# Altium project RF315Mhz.PrjPcb
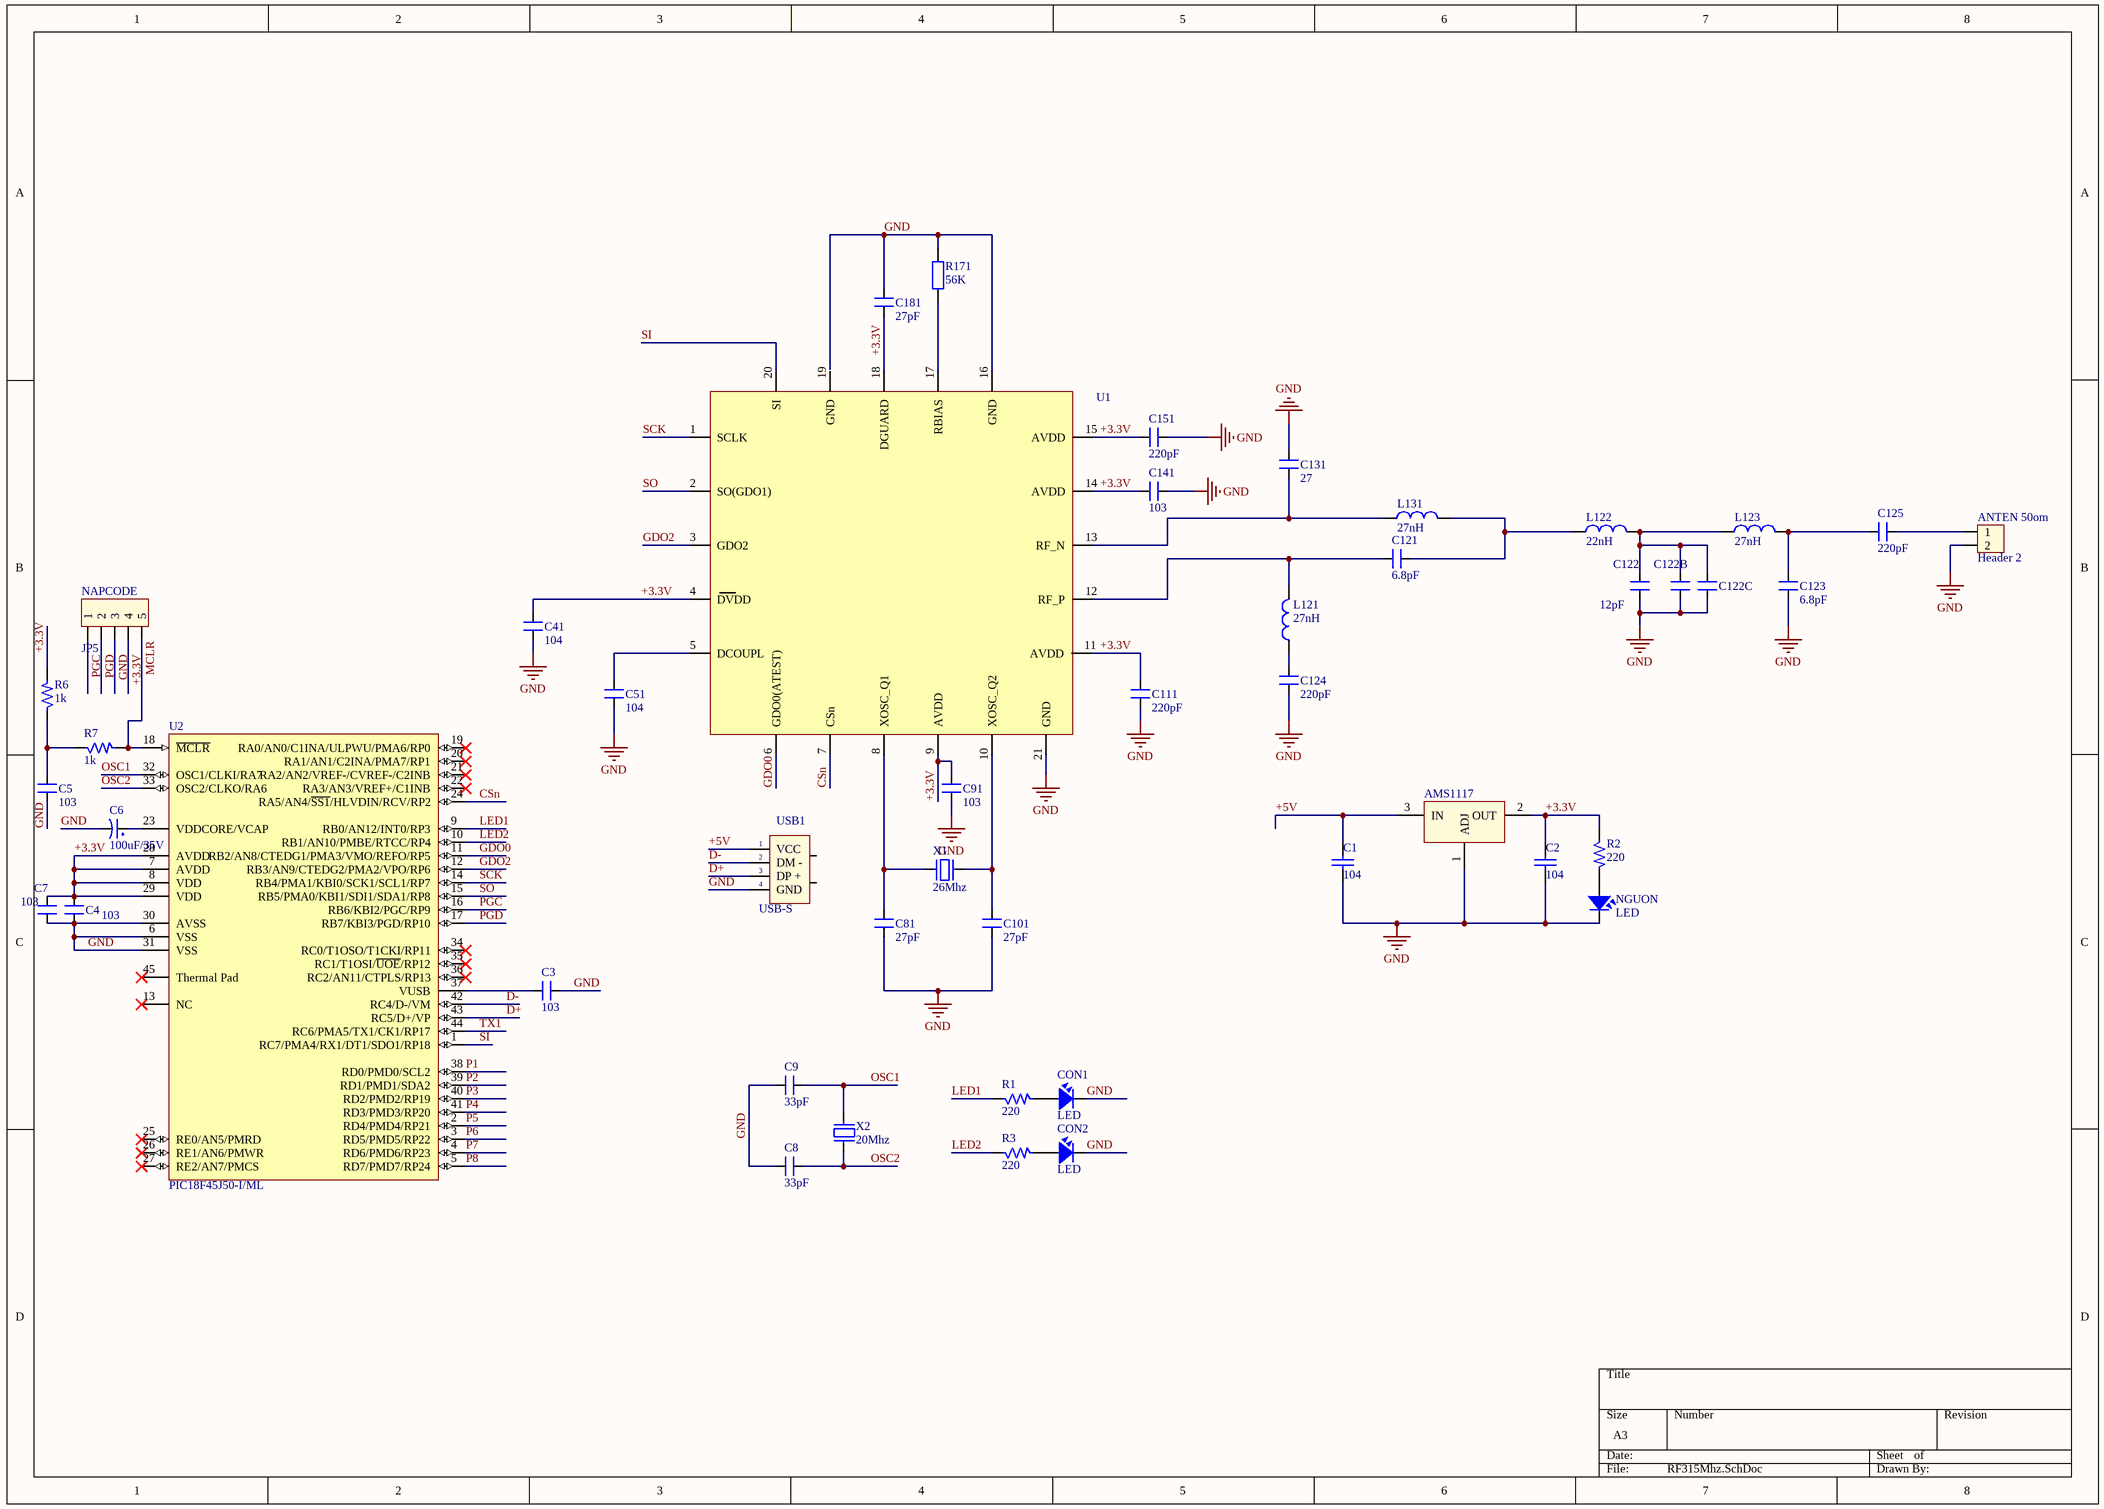
[diagram p0: RF315Mhz.SchDoc]
1 sheet, 47 parts. Net scope: global (net labels, ports and power ports of the same name join across sheets).
Board file: PCB1.PcbDoc

## Sheet RF315Mhz.SchDoc
size A3; PageSetup: Record=PageOptions|CenterHorizontal=True|CenterVertical=True|PrintScale=1.00|XCorrection=1.00|YCorrection=1.00|PrintKind=1|BorderSize=5000000|LeftOffset=0|BottomOffset=0|Orientation=2|PaperLength=1000|PaperWidth=1000|Scale=100|PaperSource=7|PrintQuality=-4|MediaType=1|DitherType=10|PaperKind=A4|PrintScaleMode=1

### Parts
AMS1117  LM317  [SOT223-4N]  (value not drawn)
ANTEN_50om  Header 2  [MCX5.08-H5]
C1  104  [0603ESDA]
C2  104  [0603ESDA]
C3  103  [SM-0805]
C4  103  [SM-0805]
C5  103  [SM-0805]
C6  100uF/35V  [CP1/2.5_SM]
C7  103  [SM-0805]
C8  33pF  [SM-0805]
C9  33pF  [SM-0805]
C41  104  [0603ESDA]
C51  104  [0603ESDA]
C81  27pF  [0603ESDA]
C91  103  [0603ESDA]
C101  27pF  [0603ESDA]
C111  220pF  [0603ESDA]
C121  6.8pF  [0603ESDA]
C122  12pF  [0603ESDA]
C122B  12pF  [0603ESDA]  (value not drawn)
C122C  12pF  [0603ESDA]  (value not drawn)
C123  6.8pF  [0603ESDA]
C124  220pF  [0603ESDA]
C125  220pF  [0603ESDA]
C131  27  [0603ESDA]
C141  103  [0603ESDA]
C151  220pF  [0603ESDA]
C181  27pF  [0603ESDA]
CON1  LED  [LED3mm]
CON2  LED  [LED3mm]
L121  27nH  [SM-0805]
L122  22nH  [SM-0805]
L123  27nH  [SM-0805]
L131  27nH  [SM-0805]
NAPCODE  JP5  [CON5]
NGUON  LED  [LED0805]
R1  220  [SM-0805]
R2  220  [SM-0805]
R3  220  [SM-0805]
R6  1k  [SM-0805]
R7  1k  [SM-0805]
R171  56K  [SM-0805]
U1  CC1101  [QFN-20Pin]  (value not drawn)
U2  PIC18F45J50-I/ML  [PIC18F45J50SMD]
USB1  USB-S  [USB-A]
X1  26Mhz  [XT2]
X2  20Mhz  [XT2]

### Nets
GND: AMS1117.1(ADJ) ANTEN_50om.2 C1.1 C2.1 C3.2 C4.2 C5.1 C6.2 C7.1 C8.1 C9.1 C41.1 C51.1 C81.1 C91.1 C101.1 C111.1 C122.2 C122B.2 C122C.2 C123.2 C124.1 C131.2 C141.1 C151.2 C181.2 CON1.2 CON2.2 NAPCODE.3 NGUON.2 R171.2 U1.16(GND) U1.21(GND) U2.6(VSS) U2.30(AVSS) U2.31(VSS) USB1.4(GND)
+3.3V: AMS1117.2(OUT) C2.2 C4.1 C7.2 C41.2 C91.2 C111.2 C141.2 C151.1 C181.1 NAPCODE.4 R2.1 R6.2 U1.4(DVDD) U1.9(AVDD) U1.11(AVDD) U1.14(AVDD) U1.15(AVDD) U1.18(DGUARD) U2.7(AVDD) U2.8(VDD) U2.28(AVDD) U2.29(VDD)
+5V: AMS1117.3(IN) C1.2 USB1.1(VCC)
CSn: U1.7(CSn) U2.24(RA5/AN4/~{SS1}/HLVDIN/RCV/RP2)
D+: U2.43(RC5/D+/VP) USB1.3(DP_+)
D-: U2.42(RC4/D-/VM) USB1.2(DM_-)
GDO0: U1.6(GDO0(ATEST)) U2.11(RB2/AN8/CTEDG1/PMA3/VMO/REFO/RP5)
GDO2: U1.3(GDO2) U2.12(RB3/AN9/CTEDG2/PMA2/VPO/RP6)
LED1: R1.1 U2.9(RB0/AN12/INT0/RP3)
LED2: R3.1 U2.10(RB1/AN10/PMBE/RTCC/RP4)
MCLR: NAPCODE.5 R7.2 U2.18(~{MCLR})
OSC1: C9.2 U2.32(OSC1/CLKI/RA7) X2.2
OSC2: C8.2 U2.33(OSC2/CLKO/RA6) X2.1
P1: U2.38(RD0/PMD0/SCL2)
P2: U2.39(RD1/PMD1/SDA2)
P3: U2.40(RD2/PMD2/RP19)
P4: U2.41(RD3/PMD3/RP20)
P5: U2.2(RD4/PMD4/RP21)
P6: U2.3(RD5/PMD5/RP22)
P7: U2.4(RD6/PMD6/RP23)
P8: U2.5(RD7/PMD7/RP24)
PGC: NAPCODE.1 U2.16(RB6/KBI2/PGC/RP9)
PGD: NAPCODE.2 U2.17(RB7/KBI3/PGD/RP10)
SCK: U1.1(SCLK) U2.14(RB4/PMA1/KBI0/SCK1/SCL1/RP7)
SI: U1.20(SI) U2.1(RC7/PMA4/RX1/DT1/SDO1/RP18)
SO: U1.2(SO(GDO1)) U2.15(RB5/PMA0/KBI1/SDI1/SDA1/RP8)
TX1: U2.44(RC6/PMA5/TX1/CK1/RP17)
NetANTEN_50om_1: ANTEN_50om.1 C125.2
NetC3_1: C3.1 U2.37(VUSB)
NetC5_2: C5.2 R6.1 R7.1
NetC6_1: C6.1 U2.23(VDDCORE/VCAP)
NetC51_2: C51.2 U1.5(DCOUPL)
NetC81_2: C81.2 U1.8(XOSC_Q1) X1.1
NetC101_2: C101.2 U1.10(XOSC_Q2) X1.2
NetC121_1: C121.1 L122.1 L131.2
NetC121_2: C121.2 L121.2 U1.12(RF_P)
NetC122_1: C122.1 C122B.1 C122C.1 L122.2 L123.1
NetC123_1: C123.1 C125.1 L123.2
NetC124_2: C124.2 L121.1
NetC131_1: C131.1 L131.1 U1.13(RF_N)
NetCON1_1: CON1.1 R1.2
NetCON2_1: CON2.1 R3.2
NetNGUON_1: NGUON.1 R2.2
NetR171_1: R171.1 U1.17(RBIAS)

Not connected (* = marked no-connect by the designer): U1 19(GND); U2 13(NC)* 19(RA0/AN0/C1INA/ULPWU/PMA6/RP0)* 20(RA1/AN1/C2INA/PMA7/RP1)* 21(RA2/AN2/VREF-/CVREF-/C2INB)* 22(RA3/AN3/VREF+/C1INB)* 25(RE0/AN5/PMRD)* 26(RE1/AN6/PMWR)* 27(RE2/AN7/PMCS)* 34(RC0/T1OSO/T1CKI/RP11)* 35(RC1/T1OSI/~{UOE}/RP12)* 36(RC2/AN11/CTPLS/RP13)* 45(Thermal_Pad)*; USB1 5 6

### Library data of the parts
AMS1117 = LM317: Adj Voltage +1.2 -> +37V; Value: LM317
ANTEN_50om = Hed2: Header 2 (Green); Value: Header 2
C1 C2 = Cap: Capacitor; Published: 8-Jun-2000; LatestRevisionDate: 17-Jul-2002; LatestRevisionNote: Re-released for DXP Platform.; PackageReference: RAD-0.3; Publisher: Altium Limited; PackageDescription: Radial Cap, Thru-Hole; 2 Leads; 0.3 in Pin Spacing; Value: 104
C3-C5 C7 C91 C141 = CM: Cap SMD; Value: 103
C6 = CP3: Cap 100uF/35V - 470uF/16V; Value: 100uF/35V/50V; Description 1: 1000uF/6,3V - 470uF/16V - 330uF - 25V; Description 2: 220uF/35V - 100uF/50V - 63V - 4,7uF/200V; Description 3: 22uF => 33uF100V - 3,3uF => 4,7uF/250V; Description 4: 2,2uF =>3,3uF/350 - 2,2uF/400V - 1uF/450V
C8 C9 = CN0: Cremic For Xtal 1pF => 100pF; Value: 33pF
C41 C51 C81 C101 C111 C121 C122 C122B C122C C123-C125 C131 C151 C181 = CM: Cap SMD; Value: 103
CON1 CON2 NGUON = LED: LED Single colour Green and Red; Value: LED 3 ly Single Colour
L121-L123 L131 = L1: Inductor; Value: 150 mH
NAPCODE = Con5: Connector 5; Value: Connector 5
R1-R3 R6 R7 = R: Resistor 1/4W; Value: R1/4W - 1K
R171 = RM: Resistor SMD; Value: 1K
U1 = CC1101: Transceiver 315Mhz
U2 = PIC18F45J50-I/ML: Low Power, High Performance USB Microcontroller with nanoWatt XLP Technology, 44-pin QFN, Industrial Temperature; FirstPublished: 2-Dec-2009; DatasheetVersion: revC, Oct-2009; PackageVersion: revBB, Aug-2009; PackageReference: QFN-ML44; Publisher: Altium Limited; PackageDescription: 44-Lead Plastic Quad Flat, No Lead Package (ML) - 8x8 mm Body [QFN]; Supplier 1: Digi-Key; Supplier Part Number 1: PIC18F45J50-I/ML-ND; Supplier 2: Farnell; Supplier Part Number 2: 1778475; Supplier 3: Newark; Supplier Part Number 3: 98M1822; Code_JEDEC: MO-220; Code_IPC: QFN65P800X800-44V2; ComponentLink1Description: Datasheet; ComponentLink1URL: http://ww1.microchip.com/downloads/en/DeviceDoc/39931c.pdf; ComponentLink2Description: Packaging Specification; ComponentLink2URL: http://www.microchip.com/stellent/groups/techpub_sg/documents/packagingspec/en012702.pdf; ComponentLink3Description: Microchip.com Home; ComponentLink3URL: http://www.microchip.com/
USB1 = USB_S: USB connector; Value: USB
X1 X2 = XT2: Crystal For all Crystal 2pin.; Value: 4Mhz